# EAGLE design MiniCurrentAmp (EAGLE 9.1.3)
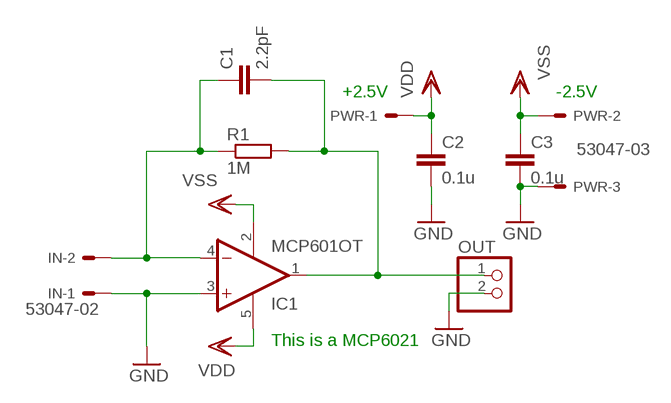
[diagram p0: schematic, sheet 1]

## Parts
C1  2.2pF  C-EUC0805  [C0805]
C2  0.1u  C-EUC0805  [C0805]
C3  0.1u  C-EUC0805  [C0805]
IC1  MCP601OT  [SOT23-5]
IN  53047-02  [53047-02]
OUT  PINHD-1X2  [1X02]
PWR  53047-03  [53047-03]
R1  1M  R-EU_R0805  [R0805]

## Nets
GND: C2.2 C3.2 IC1.3(+IN) IN.1 OUT.2 PWR.3
N$1: C1.1 IC1.4(-IN) IN.2 R1.1
N$2: C1.2 IC1.1(OUT) OUT.1 R1.2
VDD: C2.1 IC1.5(V+) PWR.1
VSS: C3.1 IC1.2(V-) PWR.2

## Notes on the sheet
- +2.5V | -2.5V
- This is a MCP6021

## Library data of the parts
C1-C3 = rcl:C-EU: CAPACITOR, European symbol; SPICEPREFIX: C
IC1 = linear:MCP601: Single Op Amp 2.7V to 6.0V Single Supply CMOS Source: http://ww1.microchip.com/downloads/en/DeviceDoc/21314g.pdf
IN = con-molex:53?-02: CONNECTOR wire to board 1.25 mm (.049 inch) pitch header; MF: MOLEX; MPN: 53047-0210; OC_FARNELL: 9733051; OC_NEWARK: 57H4701
OUT = pinhead:PINHD-1X2: PIN HEADER
PWR = con-molex:53?-03: CONNECTOR wire to board 1.25 mm (.049 inch) pitch header; MF: MOLEX; MPN: 530470310; OC_FARNELL: 9732853; OC_NEWARK: 14R5412
R1 = rcl:R-EU_: RESISTOR, European symbol; SPICEPREFIX: R

## Board
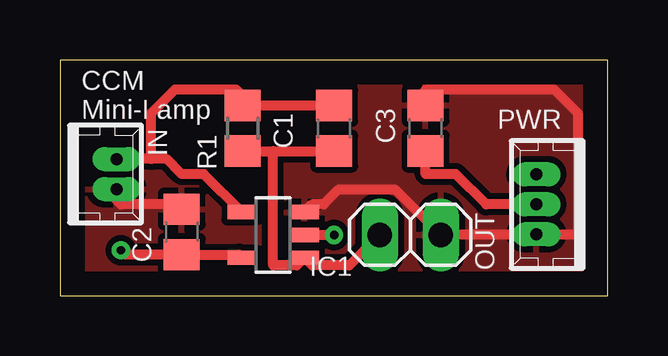
[diagram p1: board, top side]
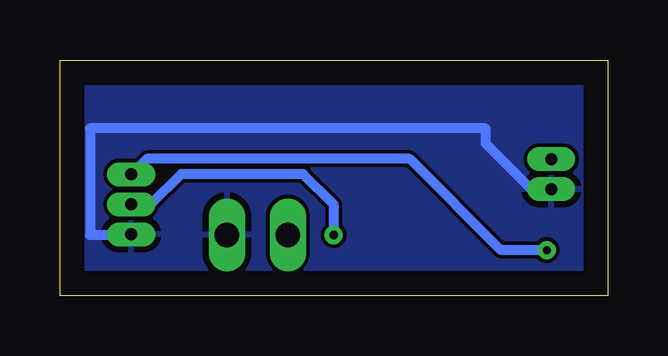
[diagram p2: board, bottom side, seen from below]

Size 22.84 x 9.83 mm. Coordinates in mm from the lower left corner, seen from the top.
Outline: 0,0 22.84,0 22.84,9.83 0,9.83 0,0
Copper layers (1*16): Top 0.035mm / dielectric 1.5mm / Bottom 0.035mm
Design rules "default": minimum track width 6mil, minimum drill 0.35mm, track to track 6mil, track to pad 6mil, pad to pad 6mil, via to via 6mil, smd to smd 6mil, copper to edge 40mil, drill to drill 6mil, minimum pad ring 10mil, minimum via ring 8mil, stop-mask expansion 4mil, vias tented up to drill 0mil, thermal gap 10mil

### Footprints (pad centres in the part's own frame; a part is rotated, then mirrored left to right if it is on the bottom)
C0805 = smd 1.3 x 1.5: 1 -0.95,0; 2 0.95,0
SOT23-5 = smd 0.6 x 1.2: 1 -0.95,-1.306; 2 0,-1.306; 3 0.95,-1.306; 4 0.95,1.306; 5 -0.95,1.306
53047-02 = drill 0.5 pad 0.698 long: 1 0.625,0.45; 2 -0.625,0.45
1X02 = drill 1.016 long: 1 -1.27,0; 2 1.27,0
53047-03 = drill 0.5 pad 0.698 long: 1 1.25,0.45; 2 0,0.45; 3 -1.25,0.45
R0805 = smd 1.3 x 1.5: 1 -0.95,0; 2 0.95,0

### Placement (x,y rotation side)
C1  11.43,6.99 270 top
C2  5.08,2.67 90 top
C3  15.24,6.99 90 top
IC1  8.89,2.54 90 top
IN  1.91,5.08 270 top
OUT  14.61,2.54 0 top
PWR  20.32,3.81 90 top
R1  7.62,6.99 270 top

### Tracks (layer width: path | path; a pad name or v marks a point on that pad's centre or on a via)
GND
  Top 0.406: C3.2 15.24,8.61 20.6,8.61 21.59,7.62 21.59,2.54 19.89,2.54 PWR.3 19.85,2.54 OUT.2 13.99,4.42 11.6,4.42 10.99,3.81 10.52,3.81 IC1.3 | C2.2 4.89,3.81 2.54,3.81 2.35,4 IN.1
  Bottom 0.406: IN.1 3.19,4.46 5.08,6.35 5.08,6.99 21.59,6.99 21.59,2.54 19.89,2.54 PWR.3
  pour Top (isolate 0.254): 0,0 0,9.78 22.86,9.78 22.86,0
  pour Bottom: 0,0 0,9.78 22.86,9.78 22.86,0
N$1
  Top 0.406: C1.1 R1.1 7.62,8.33 7.34,8.61 4.8,8.61 3.81,7.62 3.81,5.71 | IC1.4 5.99,5.08 5.08,5.08 4.45,5.71 3.81,5.71 | 3.81,5.71 2.37,5.71 IN.2
N$2
  Top 0.406: OUT.1 12.06,1.27 10.52,1.27 IC1.1 9.88,1.27 8.89,1.27 8.89,6.04 | R1.2 8.89,6.04 | 8.89,6.04 C1.2
VDD  (via drill 0.35)
  Top 0.406: v2.54,1.91 2.73,1.72 C2.1 7.46,1.72 IC1.5
  Bottom 0.406: v2.54,1.91 4.45,1.91 8.26,5.71 19.21,5.71 PWR.1
VSS  (via drill 0.35)
  Top 0.406: PWR.2 17.78,3.81 16.51,5.08 15.24,5.08 C3.1 | IC1.2 v11.43,2.54
  Bottom 0.406: v11.43,2.54 11.43,3.81 12.7,5.08 17.78,5.08 19.05,3.81 PWR.2

### Text on the board
tNames: CCM / Mini-I amp